# Altium schematic sheet Ring 5_A.SchDoc
size A; DocumentNumber: 13; SheetNumber: 22; SheetTotal: 30
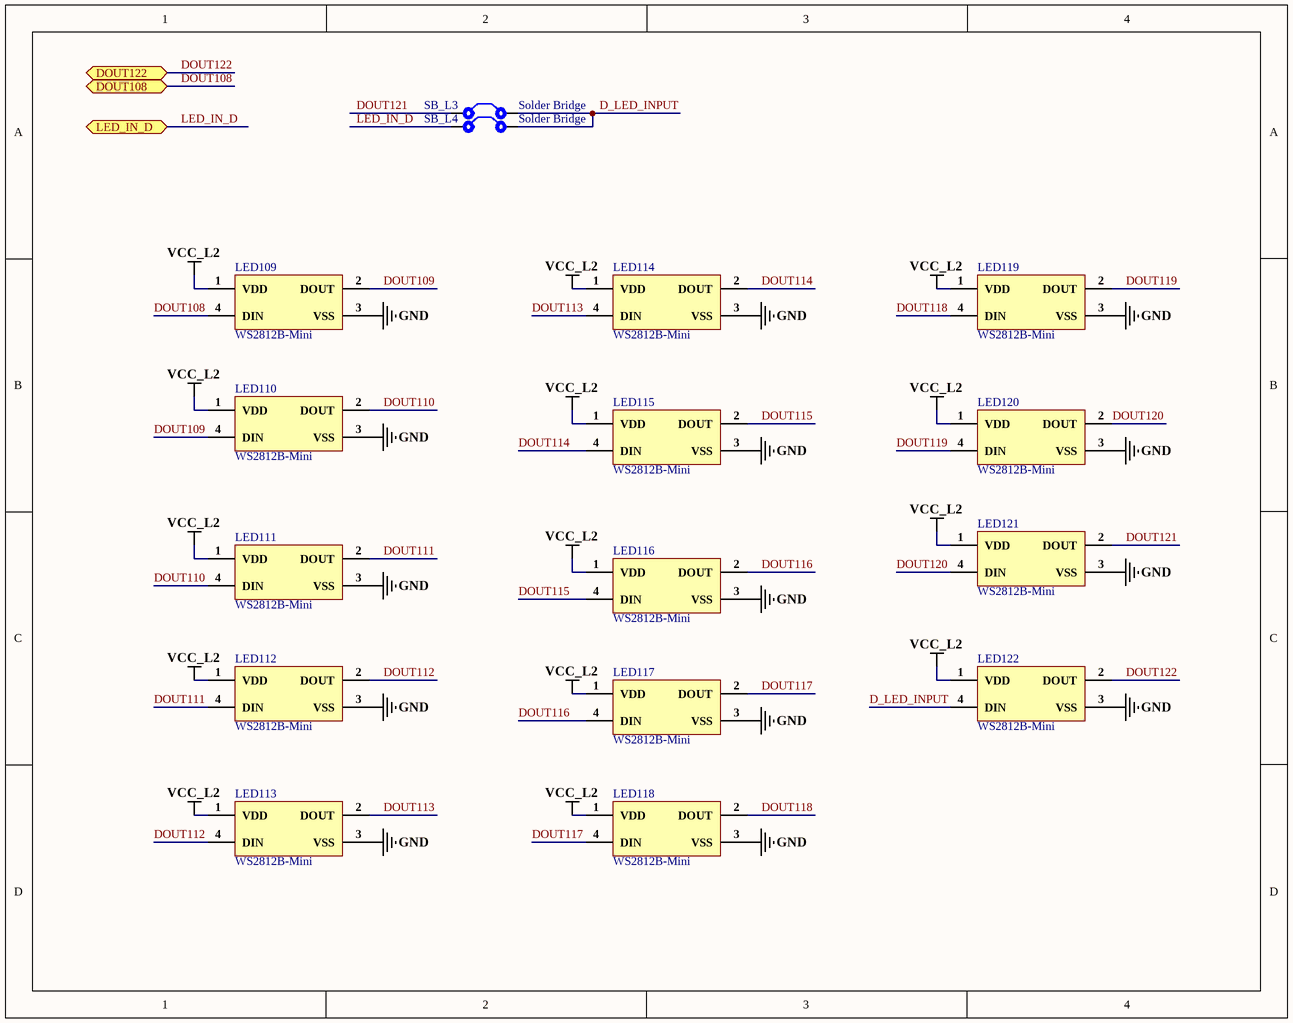
[diagram p0: Ring 5_A.SchDoc]

## Parts
LED109  WS2812B-Mini  [WS2812B-Mini]
LED110  WS2812B-Mini  [WS2812B-Mini]
LED111  WS2812B-Mini  [WS2812B-Mini]
LED112  WS2812B-Mini  [WS2812B-Mini]
LED113  WS2812B-Mini  [WS2812B-Mini]
LED114  WS2812B-Mini  [WS2812B-Mini]
LED115  WS2812B-Mini  [WS2812B-Mini]
LED116  WS2812B-Mini  [WS2812B-Mini]
LED117  WS2812B-Mini  [WS2812B-Mini]
LED118  WS2812B-Mini  [WS2812B-Mini]
LED119  WS2812B-Mini  [WS2812B-Mini]
LED120  WS2812B-Mini  [WS2812B-Mini]
LED121  WS2812B-Mini  [WS2812B-Mini]
LED122  WS2812B-Mini  [WS2812B-Mini]
SB_L3  Solder Bridge  [Solder Bridge]
SB_L4  Solder Bridge  [Solder Bridge]

## Ports
DOUT108 (bidir), DOUT122 (bidir), LED_IN_D (bidir)

## Nets
GND: LED109.3(VSS) LED110.3(VSS) LED111.3(VSS) LED112.3(VSS) LED113.3(VSS) LED114.3(VSS) LED115.3(VSS) LED116.3(VSS) LED117.3(VSS) LED118.3(VSS) LED119.3(VSS) LED120.3(VSS) LED121.3(VSS) LED122.3(VSS)
VCC_L2: LED109.1(VDD) LED110.1(VDD) LED111.1(VDD) LED112.1(VDD) LED113.1(VDD) LED114.1(VDD) LED115.1(VDD) LED116.1(VDD) LED117.1(VDD) LED118.1(VDD) LED119.1(VDD) LED120.1(VDD) LED121.1(VDD) LED122.1(VDD)
D_LED_INPUT: LED122.4(DIN) SB_L3.2 SB_L4.2
DOUT108: LED109.4(DIN) ; port DOUT108
DOUT109: LED109.2(DOUT) LED110.4(DIN)
DOUT110: LED110.2(DOUT) LED111.4(DIN)
DOUT111: LED111.2(DOUT) LED112.4(DIN)
DOUT112: LED112.2(DOUT) LED113.4(DIN)
DOUT113: LED113.2(DOUT) LED114.4(DIN)
DOUT114: LED114.2(DOUT) LED115.4(DIN)
DOUT115: LED115.2(DOUT) LED116.4(DIN)
DOUT116: LED116.2(DOUT) LED117.4(DIN)
DOUT117: LED117.2(DOUT) LED118.4(DIN)
DOUT118: LED118.2(DOUT) LED119.4(DIN)
DOUT119: LED119.2(DOUT) LED120.4(DIN)
DOUT120: LED120.2(DOUT) LED121.4(DIN)
DOUT121: LED121.2(DOUT) SB_L3.1
DOUT122: LED122.2(DOUT) ; port DOUT122
LED_IN_D: SB_L4.1 ; port LED_IN_D

## Library data of the parts
LED109-LED122 = WS2812B-Mini: SMD,3.5x3.5mm Light Emitting Diodes (LED) RoHS; Manufacturer: Worldsemi; ComponentLink1Description: LCSC; ComponentLink1URL: *https://lcsc.com/product-detail/Light-Emitting-Diodes-LED_Worldsemi-WS2812B-Mini_C527089.html; Package: SMD,3.5x3.5mm; Parameter 1: *
SB_L3 SB_L4 = Solder Bridge: Solder Bridge ON